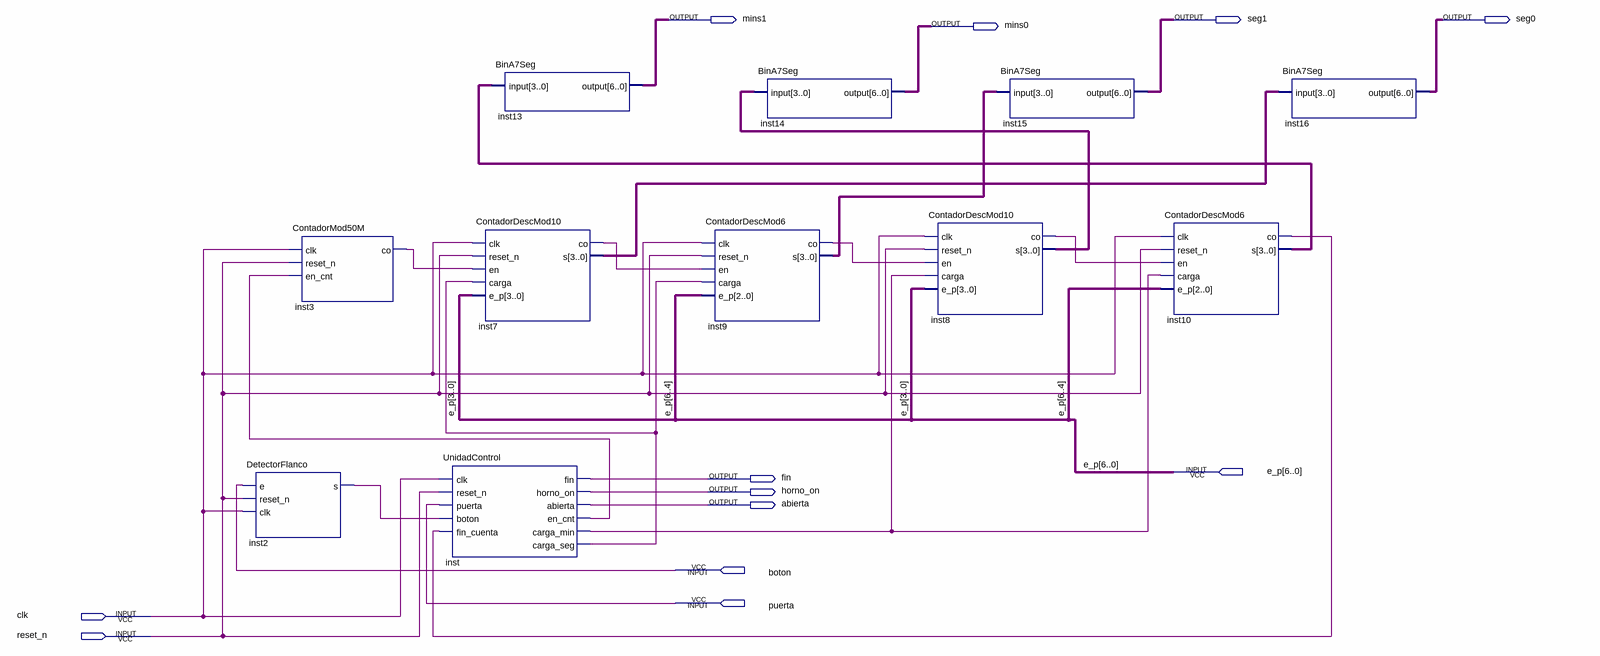
[diagram p0: schematic sheet]
// Quartus schematic todo.bdf as structural Verilog: 11 symbols, 12 pins
module todo (
  input  [6:0] e_p,
  input  boton,
  input  puerta,
  input  clk,
  input  reset_n,
  output mins1,
  output seg1,
  output seg0,
  output mins0,
  output fin,
  output horno_on,
  output abierta
);

  wire inst2_s, inst3_co, inst7_co, inst8_co, inst9_co, inst10_co, inst_carga_min, inst_carga_seg,
       inst_en_cnt;
  wire [3:0] inst7_s, inst8_s, inst9_s, inst10_s;
  wire [6:0] inst13_output, inst14_output, inst15_output, inst16_output;

  DetectorFlanco inst2 (.e(boton), .reset_n(reset_n), .clk(clk), .s(inst2_s));
  ContadorMod50M inst3 (.clk(clk), .reset_n(reset_n), .en_cnt(inst_en_cnt), .co(inst3_co));
  UnidadControl inst (
    .clk(clk), .reset_n(reset_n), .puerta(puerta), .boton(inst2_s), .fin_cuenta(inst10_co), .fin(fin),
    .horno_on(horno_on), .abierta(abierta), .en_cnt(inst_en_cnt), .carga_min(inst_carga_min),
    .carga_seg(inst_carga_seg));
  BinA7Seg inst13 (.\input (inst10_s), .\output (inst13_output));
  ContadorDescMod10 inst7 (
    .clk(clk), .reset_n(reset_n), .en(inst3_co), .carga(inst_carga_seg), .e_p(e_p[3:0]), .co(inst7_co),
    .s(inst7_s));
  ContadorDescMod6 inst9 (
    .clk(clk), .reset_n(reset_n), .en(inst7_co), .carga(inst_carga_seg), .e_p(e_p[6:4]), .co(inst9_co),
    .s(inst9_s));
  BinA7Seg inst14 (.\input (inst8_s), .\output (inst14_output));
  ContadorDescMod10 inst8 (
    .clk(clk), .reset_n(reset_n), .en(inst9_co), .carga(inst_carga_min), .e_p(e_p[3:0]), .co(inst8_co),
    .s(inst8_s));
  BinA7Seg inst15 (.\input (inst9_s), .\output (inst15_output));
  ContadorDescMod6 inst10 (
    .clk(clk), .reset_n(reset_n), .en(inst8_co), .carga(inst_carga_min), .e_p(e_p[6:4]), .co(inst10_co),
    .s(inst10_s));
  BinA7Seg inst16 (.\input (inst7_s), .\output (inst16_output));
endmodule
